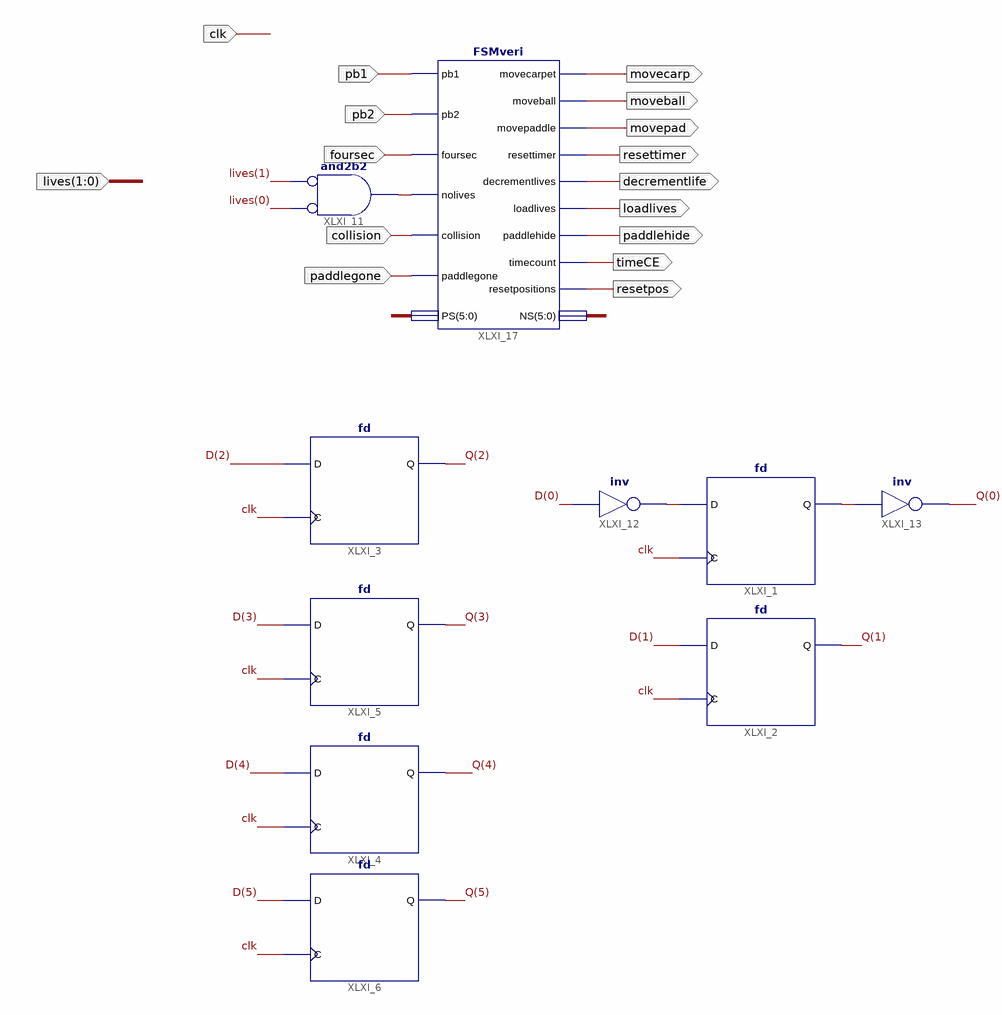
[diagram p0: schematic sheet 1]
// Xilinx ISE schematic FSMmem.sch (spartan3e) as structural Verilog: 10 symbols, 16 ports
module FSMmem (
  input  clk,
  input  [1:0] lives,
  input  pb1,
  input  pb2,
  input  foursec,
  input  collision,
  input  paddlegone,
  output movecarp,
  output movepad,
  output moveball,
  output resettimer,
  output decrementlife,
  output loadlives,
  output paddlehide,
  output timeCE,
  output resetpos
);

  wire XLXN_85, XLXN_102, XLXN_103;
  wire [5:0] D, Q;

  fd XLXI_3 (.C(clk), .D(D[2]), .Q(Q[2]));
  fd XLXI_4 (.C(clk), .D(D[4]), .Q(Q[4]));
  fd XLXI_5 (.C(clk), .D(D[3]), .Q(Q[3]));
  fd XLXI_6 (.C(clk), .D(D[5]), .Q(Q[5]));
  fd XLXI_1 (.C(clk), .D(XLXN_102), .Q(XLXN_103));
  fd XLXI_2 (.C(clk), .D(D[1]), .Q(Q[1]));
  not XLXI_12 (XLXN_102, D[0]);
  not XLXI_13 (Q[0], XLXN_103);
  FSMveri XLXI_17 (
    .pb1(pb1), .pb2(pb2), .foursec(foursec), .nolives(XLXN_85), .collision(collision),
    .paddlegone(paddlegone), .PS(Q), .movecarpet(movecarp), .moveball(moveball), .movepaddle(movepad),
    .resettimer(resettimer), .decrementlives(decrementlife), .loadlives(loadlives), .paddlehide(paddlehide),
    .timecount(timeCE), .resetpositions(resetpos), .NS(D));
  and XLXI_11 (XLXN_85, ~lives[0], ~lives[1]);  // and2b2
endmodule
